# EAGLE schematic uc4h esc kiss v100 (EAGLE 7.5.0)
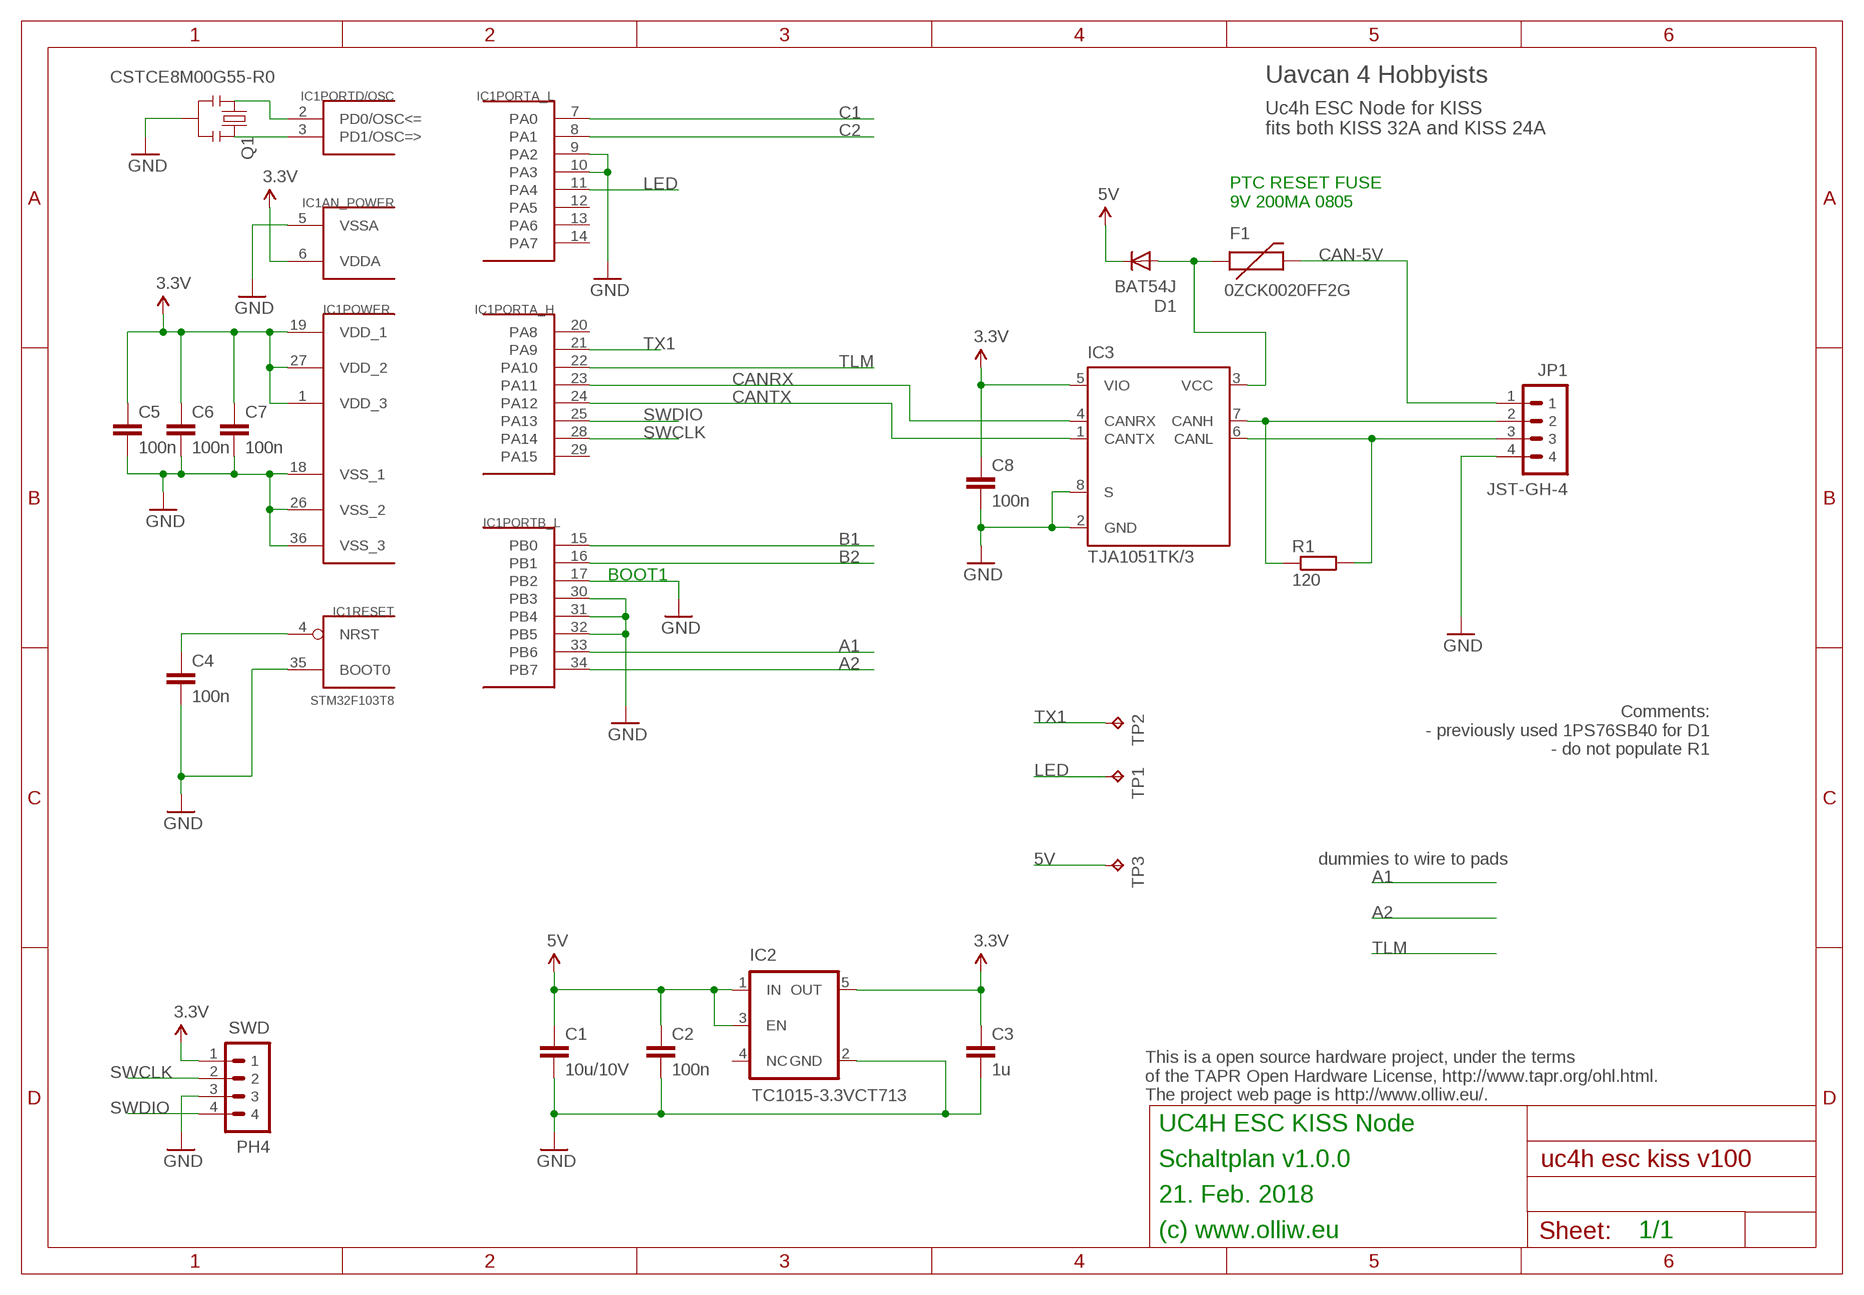
[diagram p0: schematic, sheet 1]

## Parts
C1  10u/10V  C-EUC1206  [C1206]
C2  100n  C-EUC0603K  [C0603K]
C3  1u  C-EUC0603K  [C0603K]
C4  100n  C-EUC0603K  [C0603K]
C5  100n  C-EUC0603K  [C0603K]
C6  100n  C-EUC0603K  [C0603K]
C7  100n  C-EUC0603K  [C0603K]
C8  100n  C-EUC0603K  [C0603K]
D1  BAT54J  DIODE-SOD110-R  [SOD110-R]
F1  0ZCK0020FF2G  FUSE-PTCFUSE-0805  [FUSE-0805]
IC1  STM32F103T8  STM32F10XTXU6  [VFQFPN36]
IC2  TC1015-3.3VCT713  V_REG_TPS76433SOT23-5  [SOT23-5]
IC3  TJA1051TK/3  [HVSON8]
JP1  JST-GH-4  [SM04B-GHS-TB]
Q1  CSTCE8M00G55-R0  RESONATORSMD  [RESONATOR-SMD]
R1  120  R-EU_R0603  [R0603]
SWD  PH4  P4X1_1P27-OCT_BILEX  [4X1_1P27_OCT_BILEX]
TP1  TPB1,27  [B1,27]
TP2  TPB1,27  [B1,27]
TP3  TPB1,27  [B1,27]

## Nets
3.3V: C3.1 C5.1 C6.1 C7.1 C8.1 IC1.1(POWER:VDD_3) IC1.6(AN_POWER:VDDA) IC1.19(POWER:VDD_1) IC1.27(POWER:VDD_2) IC2.5(OUT) IC3.5(VIO) SWD.1
5V: C1.1 C2.1 D1.C IC2.1(IN) IC2.3(EN) TP3.TP
A1: IC1.33(PORTB_L:PB6)
A2: IC1.34(PORTB_L:PB7)
B1: IC1.15(PORTB_L:PB0)
B2: IC1.16(PORTB_L:PB1)
C1: IC1.7(PORTA_L:PA0)
C2: IC1.8(PORTA_L:PA1)
CAN-5V: F1.2 JP1.1
CANH: IC3.7(CANH) JP1.2 R1.1
CANL: IC3.6(CANL) JP1.3 R1.2
CANRX: IC1.23(PORTA_H:PA11) IC3.4(CANRX)
CANTX: IC1.24(PORTA_H:PA12) IC3.1(CANTX)
GND: C1.2 C2.2 C3.2 C4.2 C5.2 C6.2 C7.2 C8.2 IC1.5(AN_POWER:VSSA) IC1.9(PORTA_L:PA2) IC1.10(PORTA_L:PA3) IC1.17(PORTB_L:PB2) IC1.18(POWER:VSS_1) IC1.26(POWER:VSS_2) IC1.30(PORTB_L:PB3) IC1.31(PORTB_L:PB4) IC1.32(PORTB_L:PB5) IC1.35(RESET:BOOT0) IC1.36(POWER:VSS_3) IC2.2(GND) IC3.2(GND) IC3.8(S) JP1.4 Q1.2 SWD.3
LED: IC1.11(PORTA_L:PA4) TP1.TP
N$1: C4.1 IC1.4(RESET:NRST)
N$2: D1.A F1.1 IC3.3(VCC)
N$5: IC1.2(PORTD/OSC:PD0/OSC<=) Q1.1
N$6: IC1.3(PORTD/OSC:PD1/OSC=>) Q1.3
SWCLK: IC1.28(PORTA_H:PA14) SWD.2
SWDIO: IC1.25(PORTA_H:PA13) SWD.4
TLM: IC1.22(PORTA_H:PA10)
TX1: IC1.21(PORTA_H:PA9) TP2.TP
Unconnected: IC1.12(PORTA_L:PA5) IC1.13(PORTA_L:PA6) IC1.14(PORTA_L:PA7) IC1.20(PORTA_H:PA8) IC1.29(PORTA_H:PA15) IC2.4(NC)

## Notes on the sheet
- Uavcan 4 Hobbyists
- Uc4h ESC Node for KISS
  fits both KISS 32A and KISS 24A
- PTC RESET FUSE
  9V 200MA 0805
- BOOT1
- Comments:
  - previously used 1PS76SB40 for D1
  - do not populate R1
- dummies to wire to pads
- This is a open source hardware project, under the terms
  of the TAPR Open Hardware License, http://www.tapr.org/ohl.html.
  The project web page is http://www.olliw.eu/.
- UC4H ESC KISS Node
- Schaltplan v1.0.0
- 21. Feb. 2018
- (c) www.olliw.eu | 1/1

## Library data of the parts
C1-C8 = rcl:C-EU: CAPACITOR, European symbol
D1 = diode:DIODE-: DIODE
F1 = # stdlib:FUSE-PTC
IC1 = # stm32:STM32F10XTXU6: STM32F101/103 36pad VFQPFN36
IC2 = # SparkFun2:V_REG_TPS76433: Voltage Regulator Older TI part. LDO 150mA regulator. No output by-pass cap option. See V_REG_LDO for a better part.
IC3 = # stdlib:TJA1051TK/3
JP1 = # stdlib:JST-GH-4
Q1 = # SparkFun2:RESONATOR: Resonator Small SMD resonator. This is the itty bitty 10/20MHz resonators with built in caps. CSTCE10M0G55 and CSTCE20M0V53. Footprint has been reviewed closely but hasn't been tested yet.
R1 = rcl:R-EU_: RESISTOR, European symbol
SWD = # stdlib:P4X1_1P27
TP1-TP3 = testpad:TP: Test pad